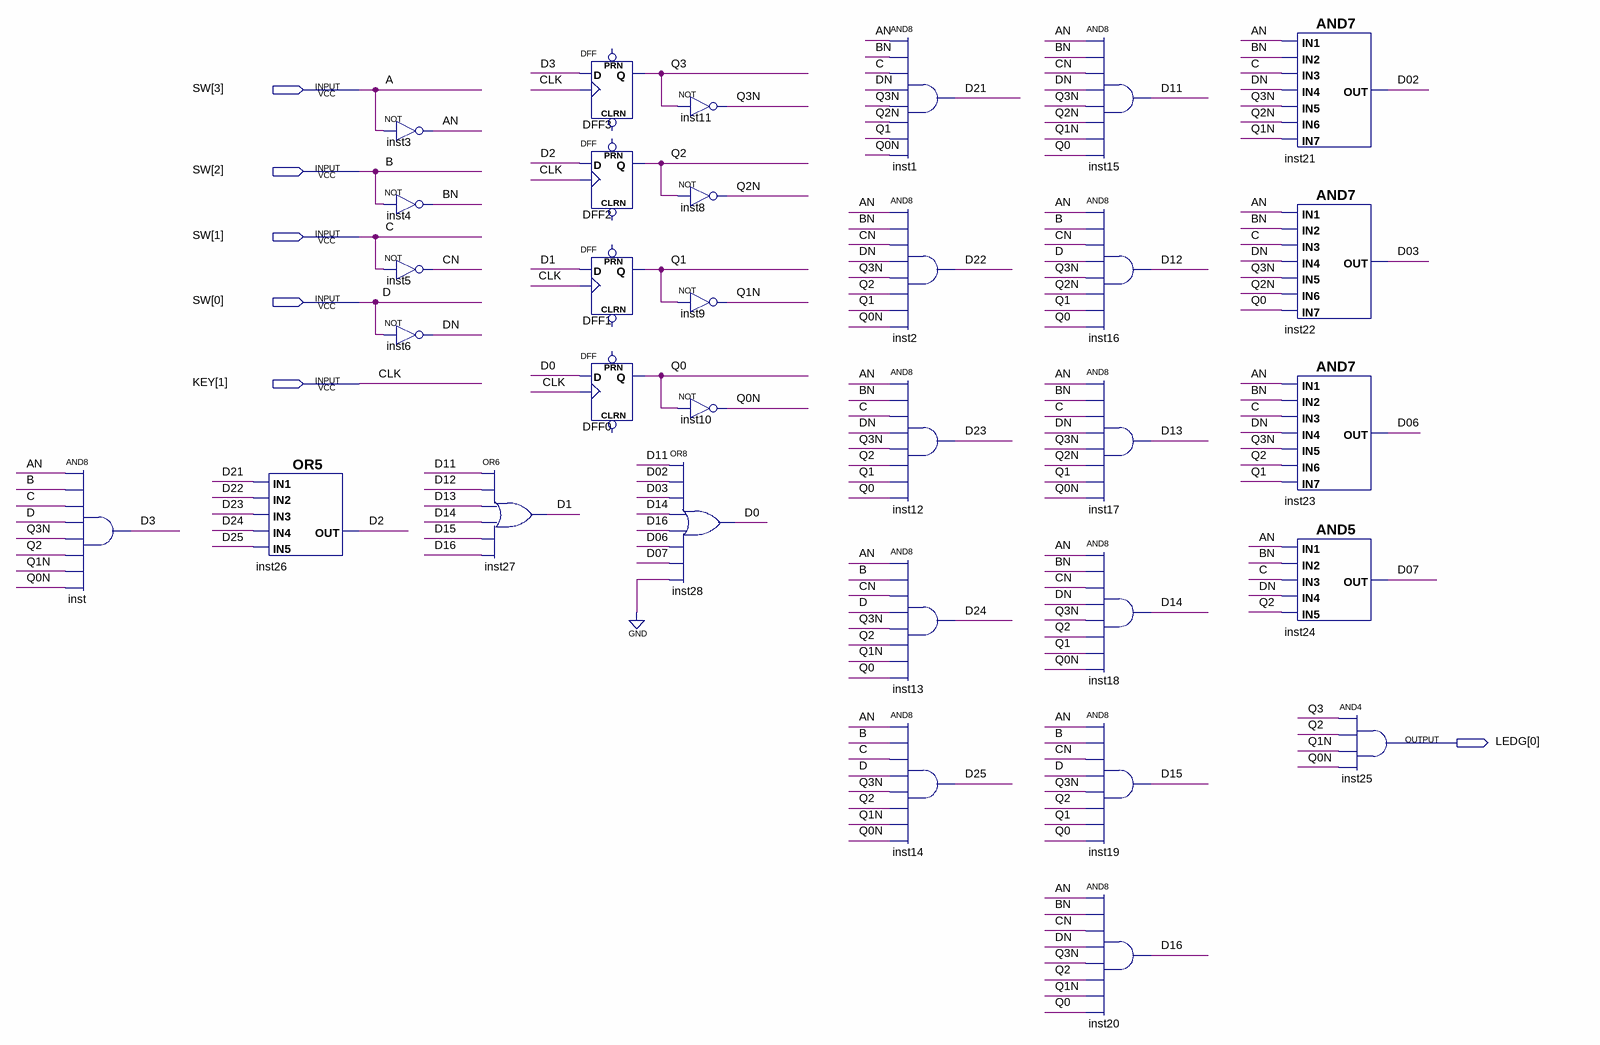
[diagram p0: schematic sheet]
// Quartus schematic MOORE.bdf as structural Verilog: 32 symbols, 6 pins
module MOORE (
  input  [3:0] SW,
  input  [1:1] KEY,
  output [0:0] LEDG
);

  wire AN, BN, CN, D0, D1, D02, D2, D3, D03, D06, D07, D11, D12, D13, D14, D15, D16, D21, D22, D23, D24, D25,
       DN, Q0, Q0N, Q1, Q1N, Q2, Q2N, Q3, Q3N;

  and inst (D3, AN, SW[2], SW[1], SW[0], Q3N, Q2, Q1N, Q0N);
  or inst26 (D2, D21, D22, D23, D24, D25);
  not inst3 (AN, SW[3]);
  not inst4 (BN, SW[2]);
  not inst5 (CN, SW[1]);
  not inst6 (DN, SW[0]);
  or inst27 (D1, D11, D12, D13, D14, D15, D16);
  DFF DFF3 (.CLK(KEY[1]), .D(D3), .Q(Q3));  // open: CLRN, PRN
  DFF DFF2 (.CLK(KEY[1]), .D(D2), .Q(Q2));  // open: CLRN, PRN
  DFF DFF1 (.CLK(KEY[1]), .D(D1), .Q(Q1));  // open: CLRN, PRN
  DFF DFF0 (.CLK(KEY[1]), .D(D0), .Q(Q0));  // open: CLRN, PRN
  not inst11 (Q3N, Q3);
  not inst8 (Q2N, Q2);
  not inst9 (Q1N, Q1);
  not inst10 (Q0N, Q0);
  or inst28 (D0, D11, D02, D03, D14, D16, D06, D07, 1'b0);
  and inst1 (D21, AN, BN, SW[1], DN, Q3N, Q2N, Q1, Q0N);
  and inst2 (D22, AN, BN, CN, DN, Q3N, Q2, Q1, Q0N);
  and inst12 (D23, AN, BN, SW[1], DN, Q3N, Q2, Q1, Q0);
  and inst13 (D24, AN, SW[2], CN, SW[0], Q3N, Q2, Q1N, Q0);
  and inst14 (D25, AN, SW[2], SW[1], SW[0], Q3N, Q2, Q1N, Q0N);
  and inst15 (D11, AN, BN, CN, DN, Q3N, Q2N, Q1N, Q0);
  and inst16 (D12, AN, SW[2], CN, SW[0], Q3N, Q2N, Q1, Q0);
  and inst17 (D13, AN, BN, SW[1], DN, Q3N, Q2N, Q1, Q0N);
  and inst18 (D14, AN, BN, CN, DN, Q3N, Q2, Q1, Q0N);
  and inst19 (D15, AN, SW[2], CN, SW[0], Q3N, Q2, Q1, Q0);
  and inst20 (D16, AN, BN, CN, DN, Q3N, Q2, Q1N, Q0);
  and inst21 (D02, AN, BN, SW[1], DN, Q3N, Q2N, Q1N);
  and inst22 (D03, AN, BN, SW[1], DN, Q3N, Q2N, Q0);
  and inst23 (D06, AN, BN, SW[1], DN, Q3N, Q2, Q1);
  and inst24 (D07, AN, BN, SW[1], DN, Q2);
  and inst25 (LEDG[0], Q3, Q2, Q1N, Q0N);

  // Other names for the same wires on the sheet: CLK = KEY[1]; D = SW[0]; C = SW[1]; B = SW[2]; A = SW[3]
endmodule
